# Altium schematic sheet PMIC_1V0.SchDoc: 1.0V Power Supply
size B; CheckedBy: Jason Sullins; Author: Jordan Harris-Toovy; Revision: 0.2; SheetNumber: 10; SheetTotal: 22; Size: ANSI B
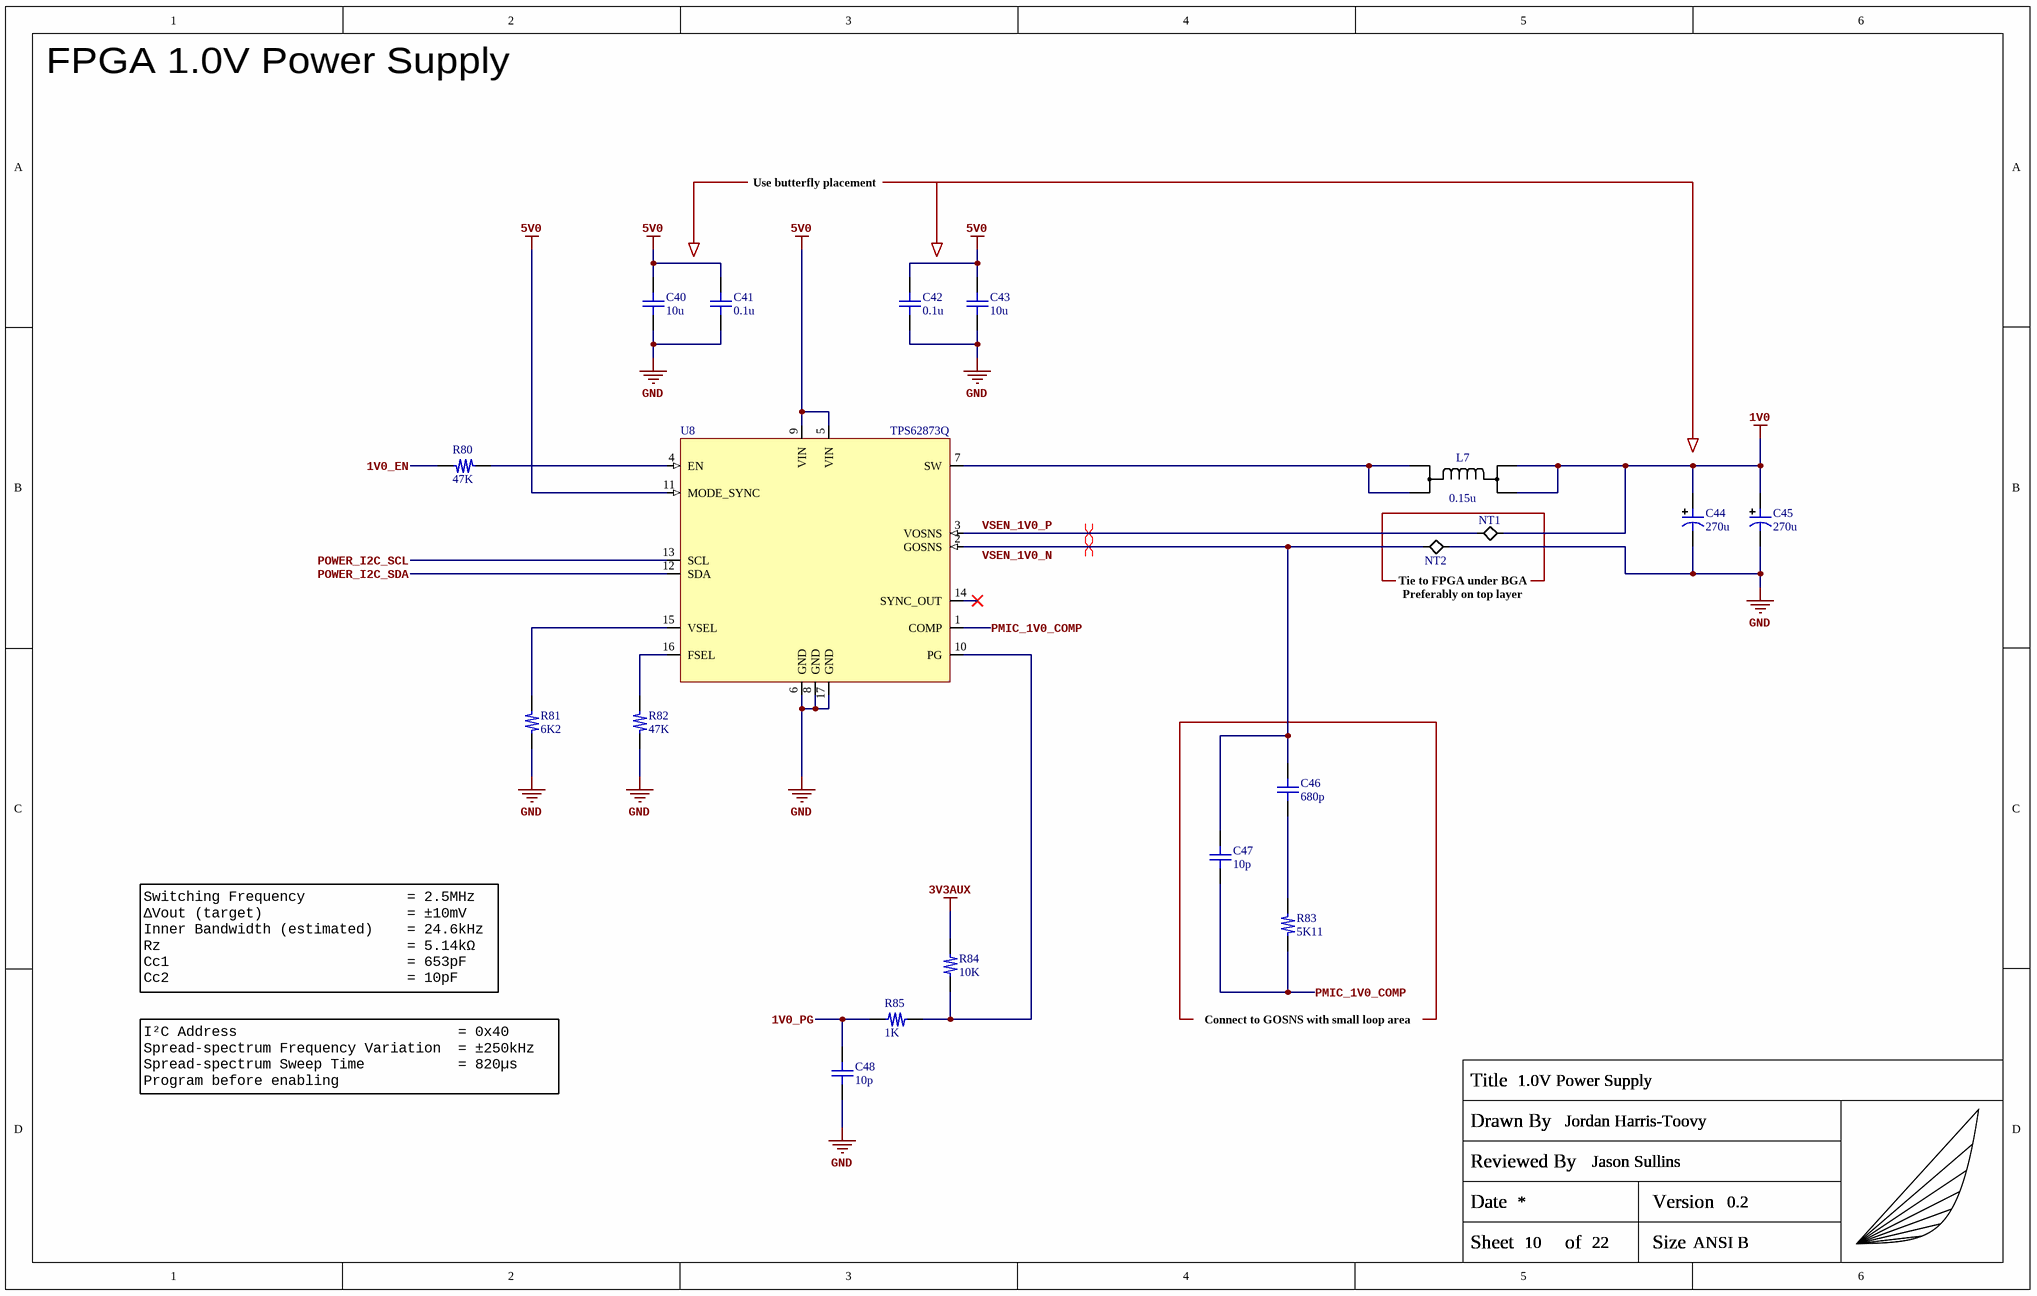
[diagram p0: PMIC_1V0.SchDoc]

## Parts
C40  10u  [C_0402_Generic]
C41  0.1u  [C_0402_Generic]
C42  0.1u  [C_0402_Generic]
C43  10u  [C_0402_Generic]
C44  270u  [C_TANT_EIA-3528-21_A]
C45  270u  [C_TANT_EIA-3528-21_A]
C46  680p  [C_0402_Generic]
C47  10p  [C_0402_Generic]
C48  10p  [C_0402_Generic]
L7  0.15u  [TDK_CLT32]
NT1  NT  [SMD_NET_TIE]  (value not drawn)  (net tie, no BOM)
NT2  NT  [SMD_NET_TIE]  (value not drawn)  (net tie, no BOM)
R80  47K  [R_0402_Generic]
R81  6K2  [R_0402_Generic]
R82  47K  [R_0402_Generic]
R83  5K11  [R_0402_Generic]
R84  10K  [R_0402_Generic]
R85  1K  [R_0402_Generic]
TITLEBLOCK?  Capstone_Title_Block  (value not drawn)  (graphical)
U8  TPS62873Q  [TPS6287x-Q1]

## Nets
1V0: C44.1 C45.1 L7.3(P3) L7.4(P4) NT1.2(P2)
3V3AUX: R84.2
5V0: C40.2 C41.2 C42.2 C43.2 U8.5(VIN) U8.9(VIN) U8.11(MODE_SYNC)
GND: C40.1 C41.1 C42.1 C43.1 C44.2 C45.2 C48.1 NT2.2(P2) R81.1 R82.1 U8.6(GND) U8.8(GND) U8.17(GND)
1V0_EN: R80.2
1V0_PG: C48.2 R85.1
PMIC_1V0_COMP: C47.1 R83.1 U8.1(COMP)
POWER_I2C_SCL: U8.13(SCL)
POWER_I2C_SDA: U8.12(SDA)
VSEN_1V0_N: C46.2 C47.2 NT2.1(P1) U8.2(GOSNS)
VSEN_1V0_P: NT1.1(P1) U8.3(VOSNS)
NetC46_1: C46.1 R83.2
NetL7_1: L7.1(P1) L7.2(P2) U8.7(SW)
NetR80_1: R80.1 U8.4(EN)
NetR81_2: R81.2 U8.15(VSEL)
NetR82_2: R82.2 U8.16(FSEL)
NetR84_1: R84.1 R85.2 U8.10(PG)

Not connected (* = marked no-connect by the designer): U8 14(SYNC_OUT)*

## Layout directives
differential pair; differential pair class DP_PMIC_SENSE: VSEN_1V0_N, VSEN_1V0_P

## Notes on the sheet
- FPGA 1.0V Power Supply
- Use butterfly placement
- Tie to FPGA under BGA
- Preferably on top layer
- Switching Frequency            = 2.5MHz
  ΔVout (target)                 = ±10mV
  Inner Bandwidth (estimated)    = 24.6kHz
  Rz                             = 5.14kΩ
  Cc1                            = 653pF
  Cc2                            = 10pF
- Connect to GOSNS with small loop area
- I²C Address                          = 0x40
  Spread-spectrum Frequency Variation  = ±250kHz
  Spread-spectrum Sweep Time           = 820µs
  Program before enabling
- (in symbol Capstone_Title_Block) Title; Drawn By; Reviewed By; Date; Version; Sheet; of; Size

## Library data of the parts
C40 C43 = CC0402MRX5R6BB106: 10µF 10V X5R SMD ceramic capacitor in 0402 size; Manufacturer: YAGEO; Manufacturer Part Number: CC0402MRX5R6BB106
C41 C42 = GRM155R71C104KA88D: 0.1µF 16V X7R SMD ceramic capacitor in 0402 size; Manufacturer: Murata Electronics; Manufacturer Part Number: GRM155R71C104KA88D
C44 C45 = 2TPSF270M9G: 270µF 2V 9mOhm SMD tantalum capacitor in EIA-3528-21size; Manufacturer: Panasonic; Manufacturer Part Number: 2TPSF270M9G
C46 = GCM1555C1H681FA16D: 680pF 50V C0G/NP0 SMD ceramic capacitor in 0402 size; Manufacturer: Murata Electronics; Manufacturer Part Number: GCM1555C1H681FA16D
C47 C48 = GRM1555C1H100JA01D: 10pF 50V C0G/NP0 SMD ceramic capacitor in 0402 size; Manufacturer: Murata Electronics; Manufacturer Part Number: GRM1555C1H100JA01D
L7 = CLT3217N: Inductor 150nH 3.3mOhm 25.4A AEC-Q200, TDK; Manufacturer: EPCOS/TDK; Manufacturer Part Number: CLT32-17N
NT1 NT2 = Net_Tie_SMD: SMD Net Tie; Manufacturer: NONE; Manufacturer Part Number: NONE
R80 R82 = ERJ-2RKF4702X: 47KOhm 1% 1/10W SMD resistor in 0402 size; Manufacturer: Panasonic; Manufacturer Part Number: ERJ-2RKF4702X
R81 = ERJ-2RKF6201X: 6.2KOhm 1% 1/10W SMD resistor in 0402 size; Manufacturer: Panasonic; Manufacturer Part Number: ERJ-2RKF6201X
R83 = ERJ-2RKF5111X: 5.11KOhm 1% 1/10W SMD resistor in 0402 size; Manufacturer: Panasonic; Manufacturer Part Number: ERJ-2RKF5111X
R84 = ERJ-2RKF1002X: 10KOhm 1% 1/10W SMD resistor in 0402 size; Manufacturer: Panasonic; Manufacturer Part Number: ERJ-2RKF1002X
R85 = ERJ-2RKF1001X: 1KOhm 1% 1/10W SMD resistor in 0402 size; Manufacturer: Panasonic; Manufacturer Part Number: ERJ-2RKF1001X
TITLEBLOCK? = Capstone_Title_Block: Custom title block with personal logo; Manufacturer: NONE; Manufacturer Part Number: NONE
U8 = TPS62873QWRXSRQ1: Switching Voltage Regulators Automotive 2.7-V to 6-V input, 15-A, stackable, synchronous buck converter 16-VQFN-FCRLF -40 to 125C; Manufacturer: Texas Instruments; Manufacturer Part Number: TPS62873QWRXSRQ1